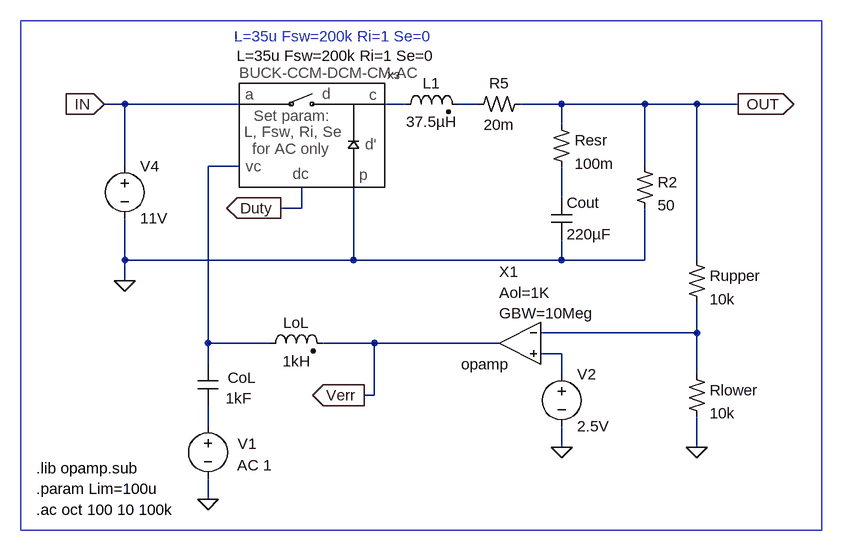
[diagram p0: schematic Switch-Mode Power Supplies - Basso- Figure 2-71.asc]
Switch-Mode Power Supplies - Basso- Figure 2-71.asc, the LTspice schematic file:
Version 4
SHEET 1 1684 1876
WIRE -320 0 -352 0
WIRE -144 0 -320 0
WIRE 112 0 80 0
WIRE 224 0 192 0
WIRE 352 0 288 0
WIRE 480 0 352 0
WIRE 560 0 480 0
WIRE 624 0 560 0
WIRE 352 32 352 0
WIRE -320 96 -320 0
WIRE -144 96 -192 96
WIRE 480 96 480 0
WIRE 352 144 352 96
WIRE -48 160 -48 128
WIRE -48 160 -80 160
WIRE -320 240 -320 176
WIRE 32 240 32 128
WIRE 32 240 -320 240
WIRE 352 240 352 208
WIRE 352 240 32 240
WIRE 480 240 480 160
WIRE 480 240 352 240
WIRE 560 240 560 0
WIRE -320 272 -320 240
WIRE 560 352 560 304
WIRE 560 352 320 352
WIRE -192 368 -192 96
WIRE -96 368 -192 368
WIRE 64 368 -16 368
WIRE 256 368 64 368
WIRE 352 384 320 384
WIRE -192 400 -192 368
WIRE 352 416 352 384
WIRE 560 416 560 352
WIRE 64 448 64 368
WIRE 64 448 48 448
WIRE -192 496 -192 464
WIRE 352 528 352 496
WIRE 560 528 560 480
WIRE -192 608 -192 576
FLAG -320 272 0
FLAG 624 0 OUT
IOPIN 624 0 Out
FLAG -352 0 IN
IOPIN -352 0 In
FLAG 48 448 Verr
IOPIN 48 448 Out
FLAG 352 528 0
FLAG 560 528 0
FLAG -192 608 0
FLAG -80 160 Duty
IOPIN -80 160 Out
SYMBOL ind2 96 16 R270
WINDOW 0 32 56 VTop 0
WINDOW 3 4 56 VBottom 0
SYMATTR InstName L1
SYMATTR Value 37.5µH
SYMBOL res2 464 96 R0
SYMATTR InstName R2
SYMATTR Value 50
SYMBOL Opamps\\opamp 288 304 M0
WINDOW 0 32 -46 Right 0
WINDOW 39 32 -14 Right 0
WINDOW 40 32 18 Right 0
SYMATTR InstName X1
SYMATTR SpiceLine Aol=1K
SYMBOL voltage -320 80 R0
WINDOW 123 0 0 Left 0
WINDOW 39 0 0 Left 0
SYMATTR InstName V4
SYMATTR Value 11V
SYMBOL voltage 352 400 R0
WINDOW 123 0 0 Left 0
WINDOW 39 0 0 Left 0
SYMATTR InstName V2
SYMATTR Value 2.5V
SYMBOL res2 288 -16 R90
WINDOW 0 0 32 VBottom 0
WINDOW 3 32 32 VTop 0
SYMATTR InstName R5
SYMATTR Value 20m
SYMBOL res2 544 416 R0
SYMATTR InstName Rlower
SYMATTR Value 10k
SYMBOL res2 544 240 R0
SYMATTR InstName Rupper
SYMATTR Value 10k
SYMBOL res2 336 32 R0
SYMATTR InstName Resr
SYMATTR Value 100m
SYMBOL cap 336 144 R0
SYMATTR InstName Cout
SYMATTR Value 220µF
SYMBOL ind2 -112 384 R270
WINDOW 0 32 56 VTop 0
WINDOW 3 4 56 VBottom 0
SYMATTR InstName LoL
SYMATTR Value 1kH
SYMBOL cap -208 400 R0
WINDOW 0 46 21 Left 0
WINDOW 3 43 53 Left 0
SYMATTR InstName CoL
SYMATTR Value 1kF
SYMBOL voltage -192 480 R0
WINDOW 0 46 43 Left 0
WINDOW 123 45 76 Left 0
WINDOW 39 0 0 Left 0
SYMATTR InstName V1
SYMATTR Value2 AC 1
SYMATTR Value ""
SYMBOL BUCK-CCM-DCM-CM-AC 0 48 R0
WINDOW 39 -148 -122 Left 0
SYMATTR SpiceLine L=35u Fsw=200k Ri=1 Se=0
SYMATTR InstName X3
TEXT -456 560 Left 0 !.lib opamp.sub
TEXT -456 624 Left 0 !.ac oct 100 10 100k
TEXT -456 592 Left 0 !.param Lim=100u
TEXT -152 -104 Left 0 ;L=35u Fsw=200k Ri=1 Se=0
RECTANGLE Normal 752 656 -480 -128

The netlist it stands for:
* Switch-Mode Power Supplies - Basso- Figure 2-71.asc
L1 N001 N002 37.5µH
R2 OUT 0 50
XX1 N005 N006 Verr opamp Aol=1K GBW=10Meg  ; pins invin noninvin out
V4 IN 0 11V
V2 N006 0 2.5V
R5 OUT N002 20m
Rlower N005 0 10k
Rupper OUT N005 10k
Resr OUT N004 100m
Cout N004 0 220µF
LoL N003 Verr 1kH
CoL N003 N007 1kF
V1 N007 0 AC 1
XX3 IN N001 0 N003 Duty BUCK-CCM-DCM-CM-AC params: L=35u Fsw=200k Ri=1 Se=0  ; pins A C P VC DC
.lib opamp.sub
.ac oct 100 10 100k
.param Lim=100u
* L=35u Fsw=200k Ri=1 Se=0
.backanno
.end